# Altium schematic sheet BMS-MCU.SchDoc
size A3; SheetNumber: 3; SheetTotal: 3
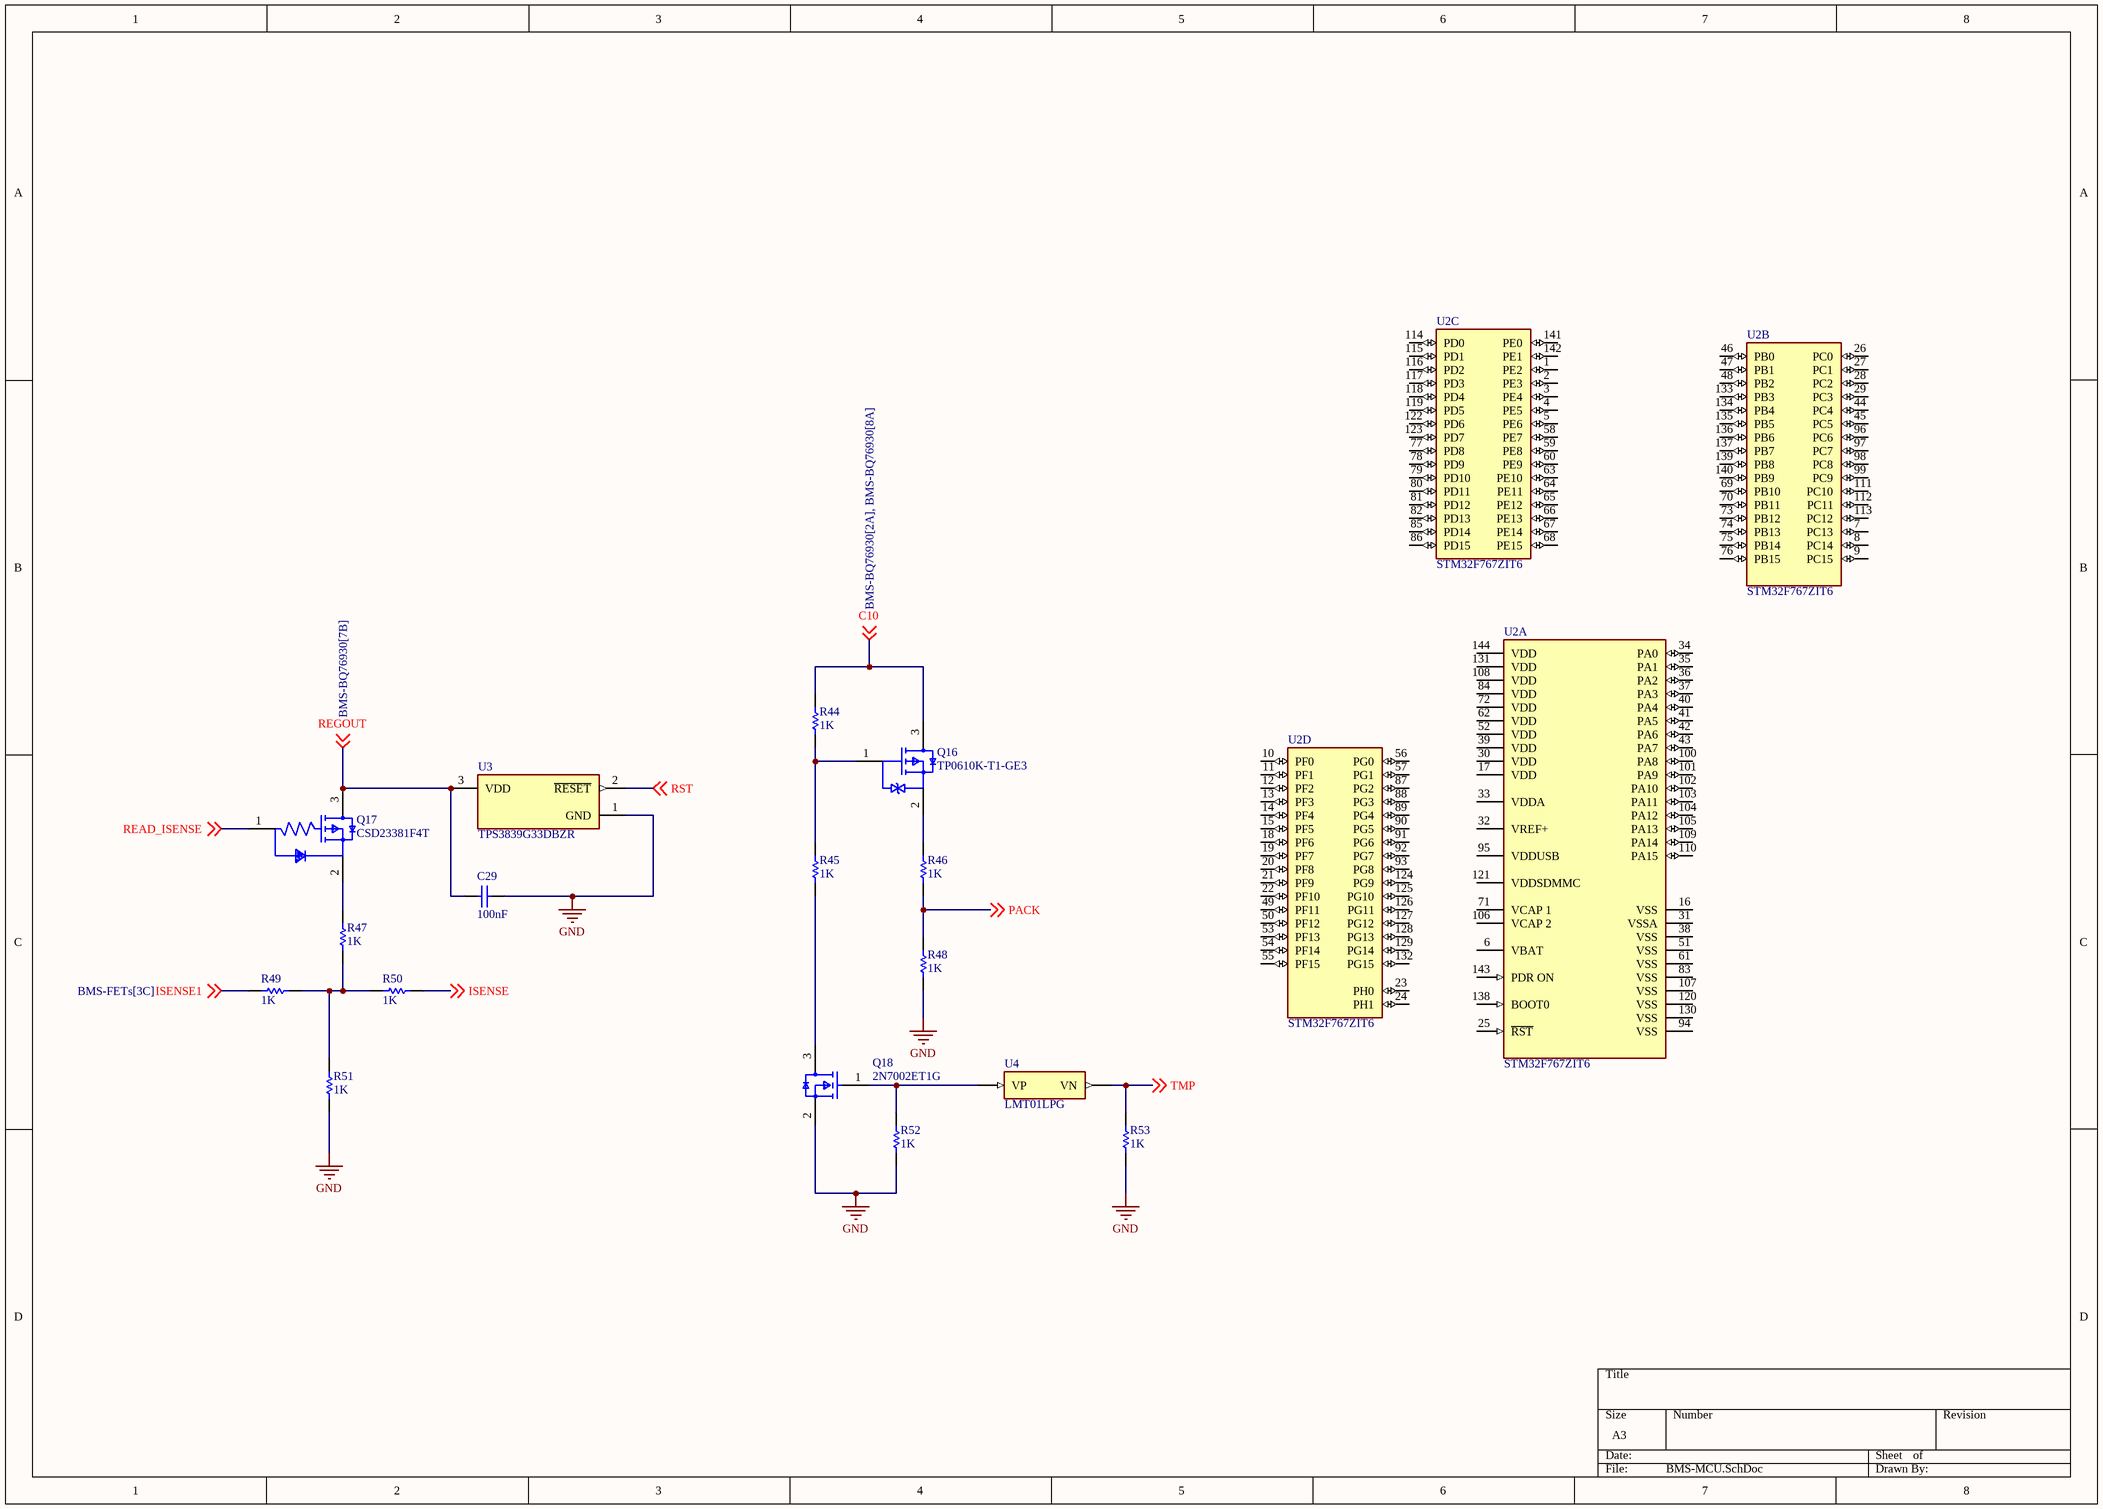
[diagram p0: BMS-MCU.SchDoc]

## Parts
C29  Capacitance: 100nF  [WCAP-CSGP_0603_L1.6W0.8H0.8_Reflow]  (hidden comment: 885012206046)
Q16  TP0610K-T1-GE3  [FP-S-03946-IPC_C]
Q17  CSD23381F4T  [FP-YJC0003A-MFG]
Q18  2N7002ET1G  [FP-318-08-MFG]
R44  value 1K  (hidden comment: Resistor)
R45  value 1K  (hidden comment: Resistor)
R46  value 1K  (hidden comment: Resistor)
R47  value 1K  (hidden comment: Resistor)
R48  value 1K  (hidden comment: Resistor)
R49  value 1K  (hidden comment: Resistor)
R50  value 1K  (hidden comment: Resistor)
R51  value 1K  (hidden comment: Resistor)
R52  value 1K  (hidden comment: Resistor)
R53  value 1K  (hidden comment: Resistor)
U2  STM32F767ZIT6  [FP-LQFP144-1A-IPC_B]  (parts A,B,C,D of 4)
U3  TPS3839G33DBZR  [FP-DBZ0003A-MFG]
U4  LMT01LPG  [FP-LPG0002A-MFG]

## Nets
GND: C29.2 Q18.2(Source) R48.1 R51.1 R52.1 R53.1 U3.1(GND)
C10: Q16.3(D) R44.2 ; off-sheet C10
ISENSE: R50.1 ; off-sheet ISENSE
ISENSE1: R49.2 ; off-sheet ISENSE1
PACK: R46.1 R48.2 ; off-sheet PACK
READ_ISENSE: Q17.1(G) ; off-sheet READ_ISENSE
REGOUT: C29.1 Q17.3(D) U3.3(VDD) ; off-sheet REGOUT
RST: U3.2(~{RESET}) ; off-sheet RST
TMP: R53.2 U4.1(VN) ; off-sheet TMP
NetQ16_1: Q16.1(G) R44.1 R45.2
NetQ16_2: Q16.2(S) R46.2
NetQ17_2: Q17.2(S) R47.2
NetQ18_1: Q18.1(Gate) R52.2 U4.2(VP)
NetQ18_3: Q18.3(Drain) R45.1
NetR47_1: R47.1 R49.1 R50.2 R51.2

Not connected (* = marked no-connect by the designer): U2 1(PE2) 2(PE3) 3(PE4) 4(PE5) 5(PE6) 6(VBAT) 7(PC13) 8(PC14) 9(PC15) 10(PF0) 11(PF1) 12(PF2) 13(PF3) 14(PF4) 15(PF5) 16(VSS) 17(VDD) 18(PF6) 19(PF7) 20(PF8) 21(PF9) 22(PF10) 23(PH0) 24(PH1) 25(~{RST}) 26(PC0) 27(PC1) 28(PC2) 29(PC3) 30(VDD) 31(VSSA) 32(VREF+) 33(VDDA) 34(PA0) 35(PA1) 36(PA2) 37(PA3) 38(VSS) 39(VDD) 40(PA4) 41(PA5) 42(PA6) 43(PA7) 44(PC4) 45(PC5) 46(PB0) 47(PB1) 48(PB2) 49(PF11) 50(PF12) 51(VSS) 52(VDD) 53(PF13) 54(PF14) 55(PF15) 56(PG0) 57(PG1) 58(PE7) 59(PE8) 60(PE9) 61(VSS) 62(VDD) 63(PE10) 64(PE11) 65(PE12) 66(PE13) 67(PE14) 68(PE15) 69(PB10) 70(PB11) 71(VCAP_1) 72(VDD) 73(PB12) 74(PB13) 75(PB14) 76(PB15) 77(PD8) 78(PD9) 79(PD10) 80(PD11) 81(PD12) 82(PD13) 83(VSS) 84(VDD) 85(PD14) 86(PD15) 87(PG2) 88(PG3) 89(PG4) 90(PG5) 91(PG6) 92(PG7) 93(PG8) 94(VSS) 95(VDDUSB) 96(PC6) 97(PC7) 98(PC8) 99(PC9) 100(PA8) 101(PA9) 102(PA10) 103(PA11) 104(PA12) 105(PA13) 106(VCAP_2) 107(VSS) 108(VDD) 109(PA14) 110(PA15) 111(PC10) 112(PC11) 113(PC12) 114(PD0) 115(PD1) 116(PD2) 117(PD3) 118(PD4) 119(PD5) 120(VSS) 121(VDDSDMMC) 122(PD6) 123(PD7) 124(PG9) 125(PG10) 126(PG11) 127(PG12) 128(PG13) 129(PG14) 130(VSS) 131(VDD) 132(PG15) 133(PB3) 134(PB4) 135(PB5) 136(PB6) 137(PB7) 138(BOOT0) 139(PB8) 140(PB9) 141(PE0) 142(PE1) 143(PDR_ON) 144(VDD)

## Library data of the parts
C29 = CMP-03913-53914755-1: 885012206046 Multilayer Ceramic Capacitor, Wcap-Csgp Series, 0.1 F, 10%, X7R, 16 V, 0603 [1608 Metric] Rohs Compliant: Yes |Wurth...; Insulation Resistance: 5GΩ; Voltage Rating (DC): 16V; Length: 1.6mm; Tolerance: 10%; NexarPartId: 53914755; Case Code (Imperial): 0603; Case/Package: 0603; Height: 800µm; Mount: Surface Mount; Case Code (Metric): 1608; Thickness: 863.6µm; Voltage Rating: 16V; Min Operating Temperature: -55°C; Max Operating Temperature: 125°C; RoHS: Compliant; Packaging: Tape & Reel (TR); REACH SVHC: Unknown; Dielectric: X7R; Width: 800µm; Supplier 1: Mouser; Supplier Part Number 1: 710-885012206046; Supplier 2: Digikey; Supplier Part Number 2: 732-7965-1-ND
Q16 = CMP-02550-000326-1: MOSFET P-CH 60V 185MA SOT23-3; Nominal Vgs: -1V; Polarity: P-CHANNEL; Power Dissipation: 350mW; Element Configuration: Single; Threshold Voltage: -2V; Turn-Off Delay Time: 35ns; Turn-On Delay Time: 20ns; Gate to Source Voltage (Vgs): 20V; Number of Elements: 1; Drain to Source Voltage (Vdss): -60V; Input Capacitance: 155pF; Rds On Max: 190mR; Continuous Drain Current (ID): -185mA; Drain to Source Resistance: 10R; Max Operating Temperature: 150°C; Height: 1.02mm; Weight: 0.050717oz; Radiation Hardening: No; Package Quantity: 1; Min Operating Temperature: -55°C; Packaging: Tape and Reel; Case/Package: SOT-23-3; Width: 1.4mm; Mount: Surface Mount; Series: TrenchFET®; Length: 3.04mm; Max Power Dissipation: 350mW; RoHS Compliant: Yes; Drain to Source Breakdown Voltage: -60V; Number of Pins: 3; Lead Free: Lead Free; Number of Channels: 1; Supplier 1: Mouser; Supplier Part Number 1: 781-TP0610K-T1-GE3
Q17 = CMP-04962-000081-1: MOSFET P-CH 12V 2.3A 3PICOSTAR; Fall Time: 7ns; Threshold Voltage: -950mV; Number of Channels: 1; Drain to Source Breakdown Voltage: -12V; Gate to Source Voltage (Vgs): -8V; Input Capacitance: 236pF; Rise Time: 3.9ns; Max Power Dissipation: 500mW; Element Configuration: Single; Drain to Source Resistance: 175mR; Turn-On Delay Time: 4.5ns; Turn-Off Delay Time: 18ns; Max Operating Temperature: 150°C; Lead Free: Lead Free; Drain to Source Voltage (Vdss): 12V; Length: 1.04mm; Number of Pins: 3; Case/Package: QFN; Continuous Drain Current (ID): 2.3A; Width: 0.64mm; Min Operating Temperature: -55°C; REACH SVHC: No SVHC; Packaging: Tape and Reel; Package Quantity: 250; Rds On Max: 175mR; Mount: Surface Mount; RoHS Compliant: Yes; Height: 0.35mm; Supplier 1: Mouser; Supplier Part Number 1: 595-CSD23381F4T; Supplier 2: Digikey; Supplier Part Number 2: 296-37782-1-ND
Q18 = CMP-1058-00769-2: MOSFET N-CH 60V 260MA SOT-23; On-State Resistance: 2.5R; Turn-Off Delay Time: 4.8ns; Nominal Vgs: 1V; Element Configuration: Single; Rise Time: 1.2ns; Input Capacitance: 26.7pF; Number of Elements: 1; Turn-On Delay Time: 1.7ns; Gate to Source Voltage (Vgs): 20V; Max Power Dissipation: 300mW; Drain to Source Breakdown Voltage: 60V; Max Operating Temperature: 150°C; REACH SVHC: No SVHC; Case/Package: SOT-23-3; Lead Free: Lead Free; Length: 2.9mm; Height: 0.94mm; Package Quantity: 3000; Min Operating Temperature: -55°C; Radiation Hardening: No; Packaging: Tape and Reel; Fall Time: 1.2ns; Drain to Source Resistance: 2.5R; Halogen Free: Halogen Free; Threshold Voltage: 1V; Number of Pins: 3; Continuous Drain Current (ID): 260mA; Rds On Max: 2.5R; Power Dissipation: 300mW; Width: 1.3mm; Supplier 1: Mouser; Supplier Part Number 1: 863-2N7002ET1G; Supplier 2: Digikey; Supplier Part Number 2: 2N7002ET1GOSCT-ND
R44-R53 = Resistor: TC1: 0; SimulationGenericComponent: True; TC2: 0
U2 = CMP-12105-000074-1: IC MCU 32BIT 2MB FLASH 144LQFP; Manufacturer: STMicroelectronics; Ram Size: 512KBytes; Number Of I/Os: 114; Core Architecture: ARM Cortex-M7; Memory Size: 2048KBytes; Standoff Height: 0.05mm; Number Of Adc Channels: 24; Max Supply Voltage: 3.6V; Number Of Pwm Channels: 4; Min Supply Voltage: 1.7V; Max Junction Temp: +105°C; Number Of Timers/Counters: 15; Number Of Usb Channels: 1; Interface: I2C,SPI,UART,USART,EBI/EMI,CAN,USB,LIN,IrDA,Ethernet,I2S; Frequency: 216MHz; Data Bus Width: 32bits; Number Of Spi Channels: 6; Number Of A/D Converters: 3; Octopart: https://octopart.com/stm32f767zit6-stmicroelectronics-70527068; Category: IC; Device Class L2: Embedded Processors and Controllers; Package: LQFP144-1A; RoHS: TRUE; Digikey Description: IC MCU 32BIT 2MB FLASH 144LQFP; ComponentLink2Description: Datasheet; Automotive: No; Mouser Description: ARM Microcontrollers - MCU High-performance and DSP with FPU, ARM Cortex-M7 MCU with 2 Mbytes Flash, 216 MHz CPU, Art Accelerator, L1 cache, SDRAM,; Ambient Temperature Range Low: -40°C; Ambient Temperature Range High: +85°C; Memory Type: FLASH; ComponentLink2URL: https://www.st.com/resource/en/datasheet/stm32f767zi.pdf; Number Of Uart Channels: 4; Temperature: -40°C to +85°C; Device Class L3: Microcontrollers; Device Class L1: Integrated Circuits (ICs); Temperature Range Low: -40°C; Temperature Range High: +85°C; Lead Free: Yes; Number Of I2C Channels: 4; Number Of Ethernet Channels: 1; Height: 1.6mm; Number Of Cores: 1; Manufacturer Part Number: STM32F767ZIT6; Ipc Land Pattern Name: QFP50P2200X2200X160-144; Supplier 1: Digikey; Supplier Part Number 1: 497-16521-ND
U3 = CMP-04919-000025-1: IC SUPERVISOR 1 CHANNEL SOT23-3; Output: TOTEM-POLE; Reset Timeout: 120ms; Quiescent Current: 150nA; Watchdog Timer: No; Reset: Active Low; Min Supply Voltage: 600mV; Threshold Voltage: 3.08V; Max Reset Threshold Voltage: 3.126V; Max Supply Voltage: 6.5V; Max Supply Current: 500nA; Min Reset Threshold Voltage: 3.003V; Number of Voltages Monitored: 1; RoHS Compliant: Yes; Number of Pins: 3; Max Operating Temperature: 85°C; Case/Package: SOT-23; Radiation Hardening: No; Packaging: Tape and Reel; Min Operating Temperature: -40°C; Type: Simple Reset/Power-On Reset; Package Quantity: 3000; Series: TPS3839G33; Mount: Surface Mount; Lead Free: Lead Free; Supplier 1: Mouser; Supplier Part Number 1: 595-TPS3839G33DBZR
U4 = CMP-04948-000023-1: SENSOR DIGITAL -50C-150C TO92-2; Manufacturer: Texas Instruments; Max Supply Voltage: 5.5V; Resolution: 13bits; Operating Supply Current: 39uA; Min Supply Voltage: 2V; Sensor Output: Analog Voltage,Other; Ambient Temperature Range Low: -50°C; Category: IC; Temperature: -50°C to +150°C; Octopart: https://octopart.com/lmt01lpg-texas+instruments-60770464; Digikey Description: SENSOR DIGITAL -50C-150C TO92-2; Temperature Range High: +150°C; Device Class L2: Temperature and Humidity Sensors; Mouser Description: 0.5°C Accurate 2-pin Temperature Sensor with a Pulse Train Interface 2-TO-92 -50 to 150; Package: LPG0002A; Ambient Temperature Range High: +150°C; Manufacturer Part Number: LMT01LPG; Lead Free: Yes; Height: 5.05mm; ComponentLink2URL: https://www.ti.com/lit/ds/symlink/lmt01.pdf; Temperature Range Low: -50°C; ComponentLink2Description: Datasheet; Automotive: No; Device Class L3: unset; RoHS: TRUE; Device Class L1: Sensors; Supplier 1: Mouser; Supplier Part Number 1: 595-LMT01LPG